# EasyEDA Pro project ProPrj_DRV8701驱动板._2024-08-31.epro

# Board DRV8701
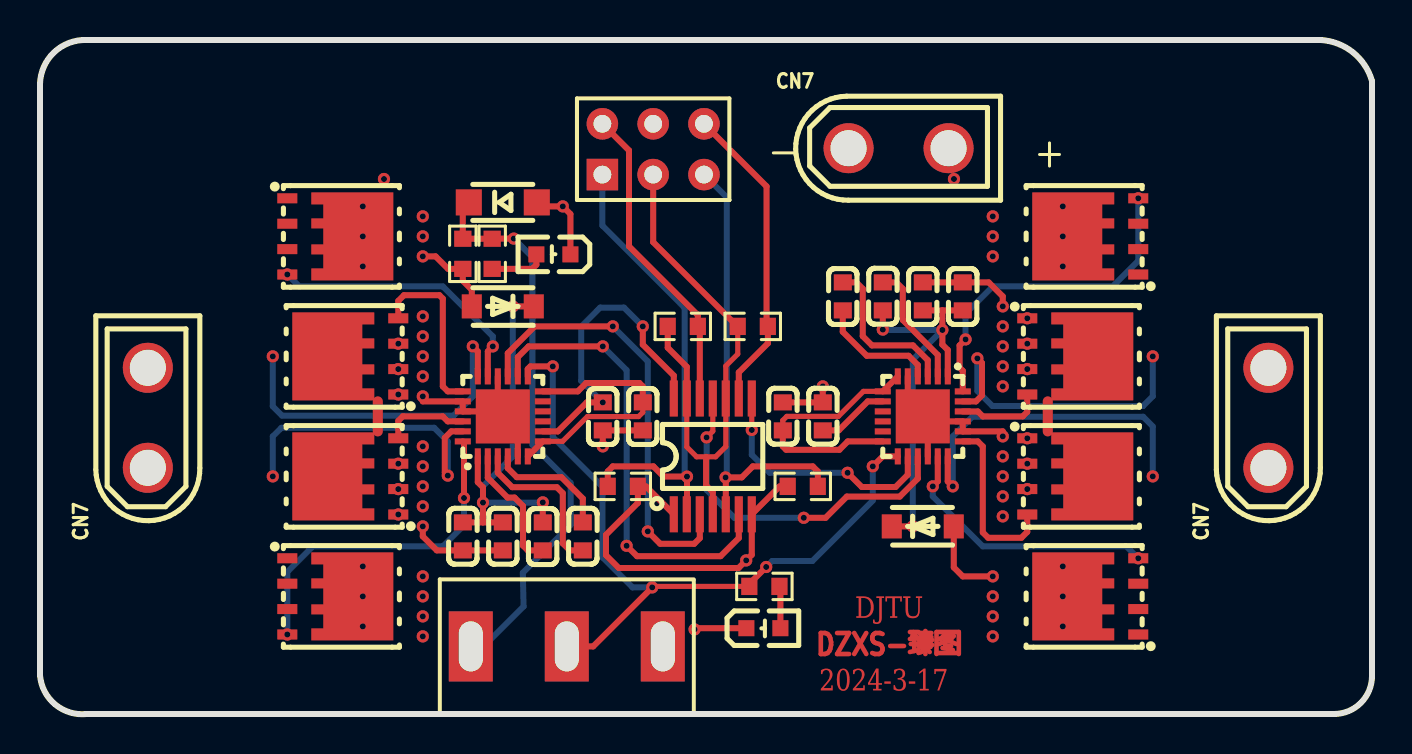
[diagram p0: board, top side]
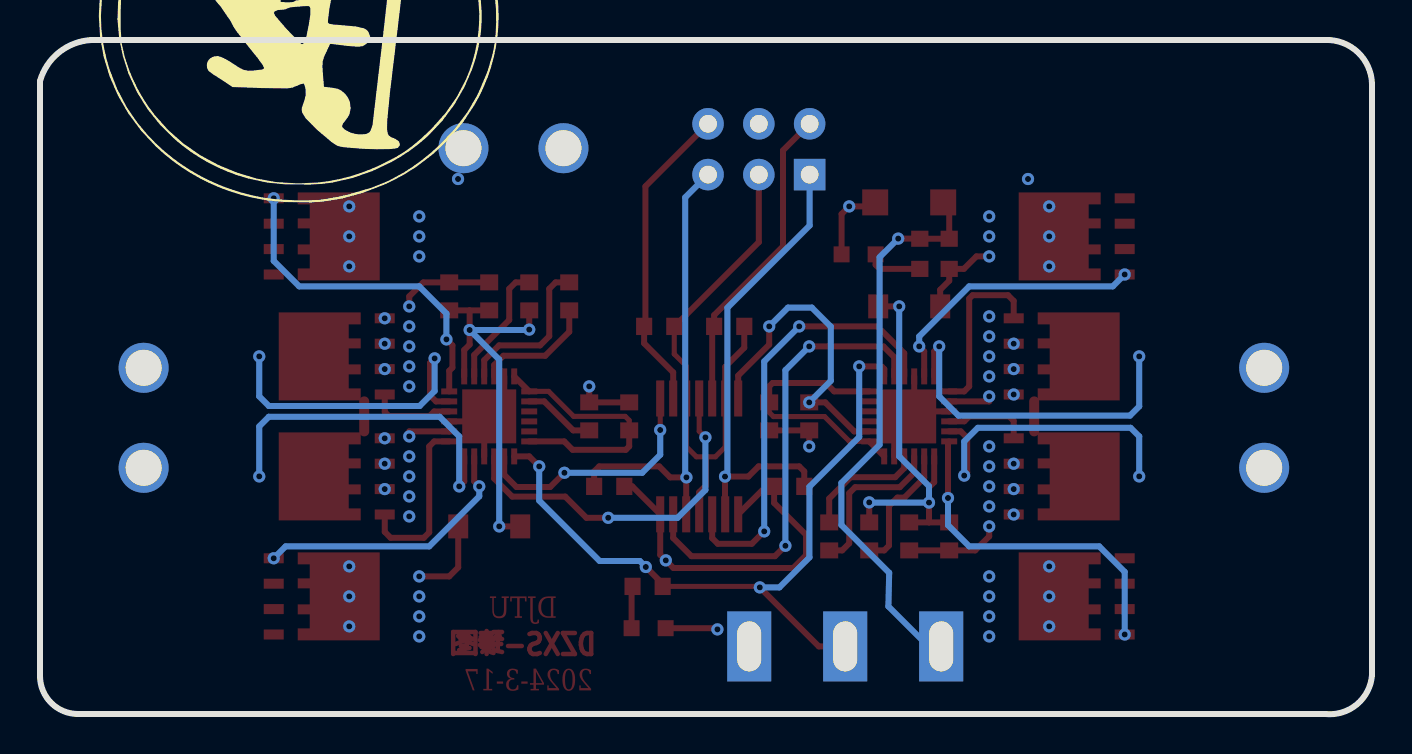
[diagram p1: board, bottom side, seen from below]

Outline 66.6 x 33.7 mm; copper layers: Top Layer, Inner1, Inner2, Bottom Layer. Coordinates in mm from the lower left corner of the outline.
Outline path: 0,31.5 0,1.94 arc(0.76,0.48) 2.34,0 64.71,0 arc(66.05,0.56) 66.6,1.89 66.6,31.65 arc(65.64,33.09) 64.03,33.7 2.34,33.7 arc(0.71,33.09) 0,31.5
Stack: Top Layer 0.035mm / Dielectric1 0.48mm PP er 4.5 / Inner1 0.035mm / Dielectric2 0.48mm FR4 er 4.5 / Inner2 0.035mm / Dielectric3 0.48mm PP er 4.5 / Bottom Layer 0.035mm

## Design rules (mm)
spacing Default (default): track to track 0.152, other pairs 0 to 0.152
track width Default (default): min 0.254, default 0.254, max 25.4
differential pair differentialPair (default): width min 0.127, default 0.254, max 2.54; gap min 0.152, default 0.152
via Default (default): diameter min 0.6, default 0.6, max 100.025; hole min 0.305, default 0.305, max 59.995
net GND uses gge2402
net VM uses gge2708
net L_B uses gge2260
net L_A uses gge2268
net R_A uses gge2396
net R_B uses gge2398
pour e85 uses gge2256
pour e362 uses gge2260
pour e363 uses gge2268
pour e364 uses gge2357
pour e365 uses gge2367
pour e366 uses gge2396
pour e367 uses gge2398
pour e368 uses gge2400
pour e369 uses gge2402
pour e370 uses gge2689
pour e371 uses gge2691
pour e372 uses gge2706
pour e373 uses gge2708

## Placement (name value [footprint] x y rotation side)
C1  100nF  [C0603]  27.14 8.88 270 top
C2  100nF  [C0603]  23.14 8.88 270 top
C3  100nF  [C0603]  40.14 20.88 90 top
C4  100nF  [C0603]  44.14 20.88 90 top
C5  10uF  [C0603]  21.14 8.88 270 top
C6  10uF  [C0603]  46.14 20.88 90 top
C7  1uF  [C0603]  25.14 8.88 90 top
C8  1uF  [C0603]  30.14 14.88 90 top
C9  1uF  [C0603]  28.14 14.88 90 top
C10  1uF  [C0603]  42.14 20.88 270 top
C11  1uF  [C0603]  37.14 14.88 270 top
C12  1uF  [C0603]  39.14 14.88 270 top
CN7  -  [CONN-TH_XT30UPB-M]  5.39 14.81 90 top
CN7#2  -  [CONN-TH_XT30UPB-M]  61.42 14.81 90 top
CN7#3  -  [CONN-TH_XT30UPB-M]  42.93 28.29 0 top
D1  1N5819W  [SOD-123F_L2.8-W1.8-LS3.7-RD]  23.14 20.38 180 top
D2  1N5819W  [SOD-123F_L2.8-W1.8-LS3.7-RD]  44.14 9.38 0 top
D3  BZT52C3V3_C908185  [SOD-123_L2.7-W1.6-LS3.7-RD]  23.14 25.58 0 top
J1  HDR-M-2.54_2x3  [HDR-M-2.54_2X3]  28.12 26.97 0 top
LED1  19-217/GHC-YR1S2/3T  [LED0603-R-RD]  25.67 22.98 180 top
LED2  19-217/GHC-YR1S2/3T  [LED0603-R-RD]  36.17 4.29 0 top
Q1  TPH1R403NL  [POWERVDFN-8_L6.2-W5.2-P1.27-LS6.0-BL]  53.14 23.88 90 top
Q2  TPH1R403NL  [POWERVDFN-8_L6.2-W5.2-P1.27-LS6.0-BL]  51.14 17.88 270 top
Q3  TPH1R403NL  [POWERVDFN-8_L6.2-W5.2-P1.27-LS6.0-BL]  53.14 5.88 90 top
Q4  TPH1R403NL  [POWERVDFN-8_L6.2-W5.2-P1.27-LS6.0-BL]  51.14 11.88 270 top
Q5  TPH1R403NL  [POWERVDFN-8_L6.2-W5.2-P1.27-LS6.0-BL]  16.14 17.88 90 top
Q6  TPH1R403NL  [POWERVDFN-8_L6.2-W5.2-P1.27-LS6.0-BL]  14.14 23.88 270 top
Q7  TPH1R403NL  [POWERVDFN-8_L6.2-W5.2-P1.27-LS6.0-BL]  16.14 11.88 90 top
Q8  TPH1R403NL  [POWERVDFN-8_L6.2-W5.2-P1.27-LS6.0-BL]  14.14 5.88 270 top
R1  10K  [R0603]  29.14 11.38 0 top
R2  10K  [R0603]  38.14 11.38 180 top
R3  10K  [R0603]  32.14 19.38 0 top
R4  10K  [R0603]  35.64 19.38 0 top
R5  330  [R0603]  36.22 6.38 0 top
R6  330  [R0603]  22.61 23.01 90 top
R7  2.2K  [R0603]  21.14 23.01 90 top
S1  SW-SPDT  [SS12D10]  26.34 3.38 180 top
U2  SN74HC125PWR  [TSSOP-14_L5.0-W4.4-P0.65-LS6.5-BL]  33.64 12.88 0 top
U3  DRV  [VQFN-24_L4.0-W4.0-P0.50-LS4.0-BL-EP]  44.14 14.88 180 top
U4  DRV  [VQFN-24_L4.0-W4.0-P0.50-LS4.0-BL-EP]  23.14 14.88 0 top

## Footprints (pads in the part's own frame, mm; a bottom-side part is the same pattern mirrored in y, then rotated)
C0603
  rect 0.8x0.9 smd: 1(-0.7,0) 2(0.7,0)
CONN-TH_XT30UPB-M
  round 2.5 hole 1.8: 1(-2.5,0) 2(2.5,0)
HDR-M-2.54_2X3
  rect 1.575x1.575 hole 0.889: 1(0,0)
  round 1.575 hole 0.889: 2(0,2.54) 3(2.54,0) 4(2.54,2.54) 5(5.08,0) 6(5.08,2.54)
LED0603-R-RD
  rect 0.8x0.8 smd: 1(0.851,0) 2(-0.851,0)
POWERVDFN-8_L6.2-W5.2-P1.27-LS6.0-BL
  rect 0.5x1 smd: 1(-1.905,-1.775) 2(-0.635,-1.775) 3(0.635,-1.775) 4(1.905,-1.775)
  custom 4.4x4.1 smd: 5(0,1.775)
R0603
  rect 0.806x0.864 smd: 1(-0.753,0) 2(0.753,0)
SOD-123_L2.7-W1.6-LS3.7-RD
  rect 1.3x1.3 smd: 1(-1.7,0) 2(1.7,0)
SOD-123F_L2.8-W1.8-LS3.7-RD
  rect 1x1.2 smd: 1(-1.55,0) 2(1.55,0)
SS12D10
  rect 2.2x3.5 hole 1.2x2.5: 1(-4.8,0) 2(0,0) 3(4.8,0)
TSSOP-14_L5.0-W4.4-P0.65-LS6.5-BL
  rect 0.406x1.804 smd: 1(-1.95,-2.896) 2(-1.3,-2.896) 3(-0.65,-2.896) 4(0,-2.896) 5(0.65,-2.896) 6(1.3,-2.896) 7(1.95,-2.896) 8(1.95,2.896) 9(1.3,2.896) 10(0.65,2.896) 11(0,2.896) 12(-0.65,2.896) 13(-1.3,2.896) 14(-1.95,2.896)
VQFN-24_L4.0-W4.0-P0.50-LS4.0-BL-EP
  rect 0.3x0.8 smd: 1(-1.25,-2) 2(-0.75,-2) 3(-0.251,-2) 4(0.25,-2) 5(0.75,-2) 6(1.25,-2) 13(1.25,2) 14(0.75,2) 15(0.249,2) 16(-0.25,2) 17(-0.75,2) 18(-1.25,2)
  rect 0.8x0.3 smd: 7(2.001,-1.25) 8(2.001,-0.75) 9(2.001,-0.249) 10(2.001,0.251) 11(2.001,0.751) 12(2.001,1.25) 19(-2.001,1.25) 20(-2.001,0.75) 21(-2.001,0.251) 22(-2.001,-0.248) 23(-2.001,-0.749) 24(-2.001,-1.249)
  rect 2.7x2.7 smd: 25(0.001,-0.002)

## Nets
3V3: D3.1 R6.2 R7.2 S1.3
DVDD: C9.2 U2.14 U4.8
GND: C2.2 C4.2 C5.2 C6.2 C8.1 C9.1 C11.1 C12.1 D3.2 J1.3 J1.4 LED1.2 LED2.2 Q2.1 Q2.2 Q2.3 Q4.1 Q4.2 Q4.3 Q5.1 Q5.2 Q5.3 Q7.1 Q7.2 Q7.3 R1.2 R2.2 R3.1 R4.1 U2.1 U2.4 U2.7 U2.10 U2.13 U3.5 U3.16 U3.20 U3.21 U3.25 U4.5 U4.16 U4.20 U4.21 U4.25
L_A: Q7.5 Q8.1 Q8.2 Q8.3 U4.23
L_B: Q5.5 Q6.1 Q6.2 Q6.3 U4.18
L_EH_IN: J1.5 R2.1 U2.5
L_EN: U2.6 U4.14
L_PH: U2.3 U4.15
L_PH_IN: J1.1 R1.1 U2.2
NSLEEP: R5.1 S1.2 U3.13 U4.13
R_A: Q1.1 Q1.2 Q1.3 Q2.5 U3.23
R_B: Q3.1 Q3.2 Q3.3 Q4.5 U3.18
R_EH_IN: J1.6 R4.2 U2.9
R_EN: U2.8 U3.14
R_PH: U2.11 U3.15
R_PH_IN: J1.2 R3.2 U2.12
VM: D1.2 D2.2 Q1.5 Q3.5 Q6.5 Q8.5 R7.1
$1N94: Q1.4 U3.24
$1N96: Q2.4 U3.22
$1N118: Q4.4 U3.19
$1N119: Q3.4 U3.17
$1N139: C11.2 U3.6 U3.7 U3.12
$1N142: C3.1 U3.4
$1N143: C3.2 U3.3
$1N144: C10.1 U3.2
$1N145: C4.1 C6.1 C10.2 D2.1 U3.1
$1N161: C2.1 C5.1 C7.2 D1.1 U4.1
$1N168: C7.1 U4.2
$1N169: C1.2 U4.3
$1N170: C1.1 U4.4
$1N172: C8.2 U4.6 U4.7 U4.12
$1N192: Q6.4 U4.17
$1N194: Q5.4 U4.19
$1N215: Q7.4 U4.22
$1N216: Q8.4 U4.24
$1N308: LED1.1 R6.1
$1N555: LED2.1 R5.2
$1N556: C12.2 U3.8

Pads without a net: CN7 1 2; CN7#2 1 2; CN7#3 1 2; S1 1; U3 9 10 11; U4 9 10 11

## Via types
v1: diameter 0.61, hole 0.305, Top Layer to Bottom Layer, 104 vias

## Routing (per net, layer and track width the routed paths; a pad name or vN(x,y) marks a point on that pad's centre or on a via; arc(x,y) is an arc through that point)
3V3: length 28.5
  Top Layer w0.3: 21.44,25.58 21.14,25.28 21.14,23.76 22.61,23.76 22.62,23.77 v1(23.69,23.77)
  Bottom Layer w0.3: S1.3 22.18,3.38 24.18,5.38 24.14,7.06 26.53,9.45 26.53,11.55 24.62,13.46 24.62,22.84 23.69,23.77
DVDD: length 15.9
  Top Layer w0.3: 25.14,14.13 25.89,14.13 27.34,15.58 v1(28.14,15.58) ; 30.14,19.38 30.14,18.47 31.69,16.92 U2.14
  Bottom Layer w0.3: 30.14,19.38 29.2,20.32 28.01,20.32 27.06,19.37 27.06,16.66 v1(28.14,15.58)
  vias: v1(30.14,19.38)
GND: length 88.9
  Top Layer w0.254: 34.89,19.38 34.89,18 34.29,17.4 U2.10 34.29,13.37 33.78,12.86 32.83,12.86 32.34,13.35 U2.13
  Top Layer w0.3: 22.89,15.13 23.14,14.88 23.89,14.13 23.89,12.88 ; 22.89,15.13 U4.21 U4.20 19.14,15.63 v1(19.14,15.88) ; 22.89,15.13 22.89,16.88 ; 37.14,15.58 39.14,15.58 v1(39.14,16.38) ; J1.3 30.66,23.59 34.87,19.38 34.89,19.38 ; 35.31,7.68 35.59,7.96 35.59,9.98 36.99,11.38 37.39,11.38 ; v1(28.14,13.38) 28.14,14.18 30.14,14.18 ; 23.14,8.18 19.84,8.18 19.14,8.88 v1(19.14,9.38) ; U3.25 44.39,14.63 U3.16 ; U3.25 43.39,15.63 43.39,16.88 ; U3.25 44.39,14.63 46.14,14.63 46.14,14.13 48.14,14.13 48.14,13.88 ; 31.69,9.98 30.3,11.38 29.89,11.38 29.89,10.55 28.3,8.96 28.3,7.94 28.94,7.3 34.93,7.3 v1(35.31,7.68) ; 33.31,12.86 33.31,11.42 33.64,11.09 33.64,9.98 ; v1(32.73,4.23) 32.79,4.29 LED2.2 ; 24.84,25.38 v1(26.14,25.38) 26.52,25 LED1.2 ; U2.13 32.34,17.36 31.39,18.31 31.39,19.38 ; 48.14,20.38 48.14,20.88 47.44,21.58 44.14,21.58
  Top Layer w0.5: 16.89,15.63 16.89,14.13 ; 50.39,15.63 50.39,14.13
  vias: v1(17.92,18.52) v1(17.92,17.25) v1(17.92,15.98) v1(17.92,12.52) v1(17.92,11.25) v1(17.92,9.98) v1(19.14,19.88) v1(19.14,18.88) v1(19.14,17.88) v1(19.14,16.88) v1(19.14,13.38) v1(19.14,12.38) v1(19.14,11.38) v1(19.14,10.38) v1(48.14,20.38) v1(48.14,19.38) v1(48.14,18.38) v1(48.14,17.38) v1(48.14,16.38) v1(48.14,13.88) v1(48.14,12.88) v1(48.14,11.88) v1(48.14,10.88) v1(48.14,9.88) v1(49.37,19.79) v1(49.37,18.52) v1(49.37,17.25) v1(49.37,13.79) v1(49.37,12.52) v1(49.37,11.25)
L_A: length 15.9
  Top Layer w0.3: 21.14,14.13 20.56,14.13 20.24,13.81 20.24,12.07 20.39,11.92
  Bottom Layer w0.3: v1(11.64,11.88) 11.64,13.88 12.07,14.31 19.71,14.31 20.39,13.63 20.39,11.92
  vias: v1(20.39,11.92)
L_B: length 17.2
  Top Layer w0.3: U4.18 21.89,18.13 21.64,18.38
  Bottom Layer w0.3: 11.64,17.88 11.64,15.38 12.1,14.92 20.68,14.92 21.64,15.88 21.64,18.38
  vias: v1(11.64,17.88) v1(21.64,18.38)
L_EH_IN: length 23.2
  Top Layer w0.3: 34.29,9.98 34.29,11.82 34.28,11.83 35.09,11.83 35.64,12.38 38.64,12.38 38.89,12.13 R2.1
  Bottom Layer w0.3: J1.5 34.34,25.83 34.34,11.89 v1(34.28,11.83)
L_EN: length 23.3
  Top Layer w0.3: v1(29.33,8.41) 29.85,7.89 34.03,7.89 34.94,8.8 34.94,9.98 ; v1(28.14,18.38) 24.43,18.38 23.89,17.84 23.89,16.88
  Bottom Layer w0.3: v1(28.14,18.38) 29.33,17.19 v1(29.33,8.41)
L_PH: length 22.1
  Top Layer w0.3: 32.99,9.98 32.99,8.79 32.71,8.51 31.01,8.51 30.39,9.13 ; U4.15 23.39,18.04 24.73,19.38 v1(28.64,19.38)
  Bottom Layer w0.3: 30.39,9.13 30.39,17.63 v1(28.64,19.38)
  vias: v1(30.39,9.13)
L_PH_IN: length 23.8
  Top Layer w0.3: 32.34,9.98 32.35,9.99 32.35,11.87 31.18,11.87 30.67,12.38 28.64,12.38 28.39,12.13 28.39,11.38
  Bottom Layer w0.3: J1.1 28.12,24.42 32.23,20.31 32.23,11.99 v1(32.35,11.87)
NSLEEP: length 36.9
  Top Layer w0.254: R5.1 30.66,6.38 v1(30.61,6.33)
  Top Layer w0.3: v1(41.64,12.38) 42.14,12.88 U3.13 ; S1.2 27.66,3.38 v1(30.61,6.33) ; R5.1 35.47,6.51 v1(36.31,7.35) ; U4.13 24.39,17.25 24.52,17.38 25.64,17.38
  Bottom Layer w0.3: 25.64,17.38 25.64,13.85 28.13,11.36 28.13,7.83 29.63,6.33 v1(30.61,6.33) ; v1(41.64,12.38) 41.64,10.67 38.62,7.65 36.61,7.65 v1(36.31,7.35)
  vias: v1(25.64,17.38)
R_A: length 15.9
  Top Layer w0.3: 46.14,15.63 46.8,15.63 47.1,15.93 47.1,17.55 46.87,17.78
  Bottom Layer w0.3: 46.87,17.78 46.87,16.15 47.62,15.4 55.16,15.4 55.64,15.88 55.64,17.88
  vias: v1(46.87,17.78) v1(55.64,17.88)
R_B: length 17.2
  Top Layer w0.3: 45.64,11.38 45.39,11.63 45.39,12.88
  Bottom Layer w0.3: 45.64,11.38 45.64,13.88 46.62,14.86 55.16,14.86 55.64,14.38 v1(55.64,11.88)
  vias: v1(45.64,11.38)
R_EH_IN: length 15.7
  Top Layer w0.3: J1.6 36.33,26.38 36.33,19.44 R4.2 ; 34.94,15.78 34.94,17.08 36.39,18.53 36.39,19.38
R_EN: length 12.5
  Top Layer w0.254: 35.59,15.78 35.59,14.2
  Top Layer w0.3: 40.38,12.06 41.09,11.35 42.78,11.35 43.39,11.96 U3.14
  Bottom Layer w0.3: 40.38,12.06 36.49,12.06 35.59,12.96 35.59,14.2
  vias: v1(35.59,14.2) v1(40.38,12.06)
R_PH: length 17.8
  Top Layer w0.254: v1(33.33,13.83) 33.64,14.14 33.64,15.78
  Top Layer w0.3: v1(38.19,9.81) 39.28,9.81 40.34,10.87 42.99,10.87 43.89,11.77 U3.15
  Bottom Layer w0.3: v1(38.19,9.81) 34.72,9.81 33.33,11.2 v1(33.33,13.83)
R_PH_IN: length 15.8
  Top Layer w0.3: U2.12 32.99,19.38 32.89,19.38 ; R3.2 32.89,19.94 29.45,23.38 29.45,28.18 J1.2
VM: length 8.5
  Top Layer w0.3: 21.59,20.38 21.59,21.21 21.14,21.66 21.14,22.26 20.41,22.26 19.78,22.88 v1(19.14,22.88) ; D2.2 45.69,7.33 46.14,6.88 47.64,6.88
  vias: v1(16.14,25.38) v1(16.14,23.88) v1(16.14,22.38) v1(16.14,7.38) v1(16.14,5.88) v1(16.14,4.38) v1(17.2,26.75) v1(19.14,24.88) v1(19.14,23.88) v1(19.14,6.88) v1(19.14,5.88) v1(19.14,4.88) v1(19.14,3.88) v1(45.7,26.75) v1(47.64,24.88) v1(47.64,23.88) v1(47.64,22.88) v1(47.64,6.88) v1(47.64,5.88) v1(47.64,4.88) v1(47.64,3.88) v1(51.14,25.38) v1(51.14,23.88) v1(51.14,22.38) v1(51.14,7.38) v1(51.14,5.88) v1(51.14,4.38)
$1N94: length 16.9
  Top Layer w0.3: v1(46.28,18.73) 45.98,18.43 45.98,17.32 46.14,17.16 46.14,16.13
  Bottom Layer w0.3: v1(46.28,18.73) 46.28,20.02 47.64,21.38 53.64,21.38 54.92,22.66 v1(54.92,25.79)
$1N96: length 4.3
  Top Layer w0.3: 49.36,15.98 49.36,15.11 49.14,14.88 47.14,14.88 46.89,15.13 46.14,15.13
$1N118: length 8.7
  Top Layer w0.3: 49.36,9.97 49.36,9.11 49.07,8.81 47.41,8.81 47.14,9.08 47.14,13.38 46.89,13.63 46.14,13.63
$1N119: length 13.7
  Top Layer w0.3: 44.64,11.38 44.89,11.63 U3.17
  Bottom Layer w0.3: 44.64,11.38 44.64,10.88 47.14,8.38 54.32,8.38 54.91,7.78
  vias: v1(44.64,11.38) v1(54.92,7.79)
$1N139: length 13.2
  Top Layer w0.254: 42.14,16.13 41.17,16.13 39.92,14.88 37.34,14.88 37.14,14.68 37.14,14.18
  Top Layer w0.3: 42.14,16.13 U3.6 ; 37.14,14.18 37.14,13.38 37.31,13.21 39.97,13.21 40.39,13.63 42.14,13.63
$1N142: length 6.1
  Top Layer w0.3: 40.14,20.18 40.14,19.11 41.34,17.91 43.43,17.91 43.89,17.45 U3.4
$1N143: length 8.1
  Top Layer w0.3: 40.14,21.58 40.82,21.58 41.14,21.26 41.14,18.89 41.6,18.43 43.65,18.43 44.39,17.69 U3.3
$1N144: length 6.2
  Top Layer w0.3: U3.2 44.89,17.95 43.14,19.7 43.14,21.26 42.82,21.58 42.14,21.58
$1N145: length 20.8
  Top Layer w0.3: 42.14,19.22 42.14,20.18 ; U3.1 45.39,18.2 45.12,18.47 v1(45.12,19.2) 45.12,20.18 44.14,20.18 ; 42.59,9.38 43.64,9.38 ; 46.14,20.18 45.14,20.18
  Bottom Layer w0.3: 42.14,19.22 42.16,19.2 v1(45.12,19.2) 43.64,17.72 43.64,9.38
  vias: v1(42.14,19.22) v1(43.64,9.38)
$1N161: length 20.9
  Top Layer w0.3: 21.14,9.58 22.14,9.58 ; C2.1 22.15,9.58 22.15,11.33 21.89,11.59 U4.1 ; D1.1 23.64,20.38 ; C7.2 25.14,10.58
  Bottom Layer w0.3: v1(22.15,10.57) 25.14,10.57 v1(25.14,10.58) ; 22.15,10.57 22.15,11.39 23.64,12.88 23.64,20.38
  vias: v1(23.64,20.38)
$1N168: length 6.5
  Top Layer w0.3: 22.39,12.88 22.39,11.81 23.38,10.82 23.73,10.82 24.15,10.4 24.15,8.42 24.39,8.18 25.14,8.18
$1N169: length 8.1
  Top Layer w0.3: 22.89,12.88 22.89,12.06 23.61,11.34 25.84,11.34 26.14,11.04 26.14,8.53 26.49,8.18 27.14,8.18
$1N170: length 6.2
  Top Layer w0.3: 23.39,12.88 23.39,12.29 23.84,11.84 26.07,11.84 27.14,10.77 C1.1
$1N172: length 13.2
  Top Layer w0.254: 25.14,13.63 26.13,13.63 27.37,14.87 29.93,14.87 30.14,15.08 30.14,15.58
  Top Layer w0.3: 30.14,15.58 30.14,16.38 29.97,16.55 27.31,16.55 26.89,16.13 25.14,16.13 ; U4.6 25.14,13.63
$1N192: length 13.7
  Top Layer w0.3: 22.64,18.38 22.39,18.13 U4.17
  Bottom Layer w0.3: 22.64,18.38 22.64,18.88 20.14,21.38 12.96,21.38 v1(12.37,21.98)
  vias: v1(22.64,18.38)
$1N194: length 8.8
  Top Layer w0.3: Q5.4 17.92,20.66 18.2,20.94 19.97,20.94 20.14,20.77 20.14,16.38 20.39,16.13 21.14,16.13
$1N215: length 4.3
  Top Layer w0.3: 21.14,14.63 20.39,14.63 20.14,14.88 18.14,14.88 17.92,14.66 Q7.4
$1N216: length 17.1
  Top Layer w0.3: 21.14,13.63 21.2,13.57 v1(21.2,10.8)
  Bottom Layer w0.3: 12.37,3.97 12.37,7.11 13.64,8.38 20.14,8.38 21.2,9.44 v1(21.2,10.8)
  vias: v1(12.37,3.98)
$1N308: length 2.8
  Top Layer w0.3: 22.61,22.26 24.62,22.26 24.82,22.46 LED1.1
$1N555: length 2.1
  Top Layer w0.3: LED2.1 37.02,6.33 R5.2
$1N556: length 3.6
  Top Layer w0.3: 39.14,14.18 39.94,14.18 41.39,15.63 42.14,15.63

## Copper pours and planes (outline as drawn; the poured copper is in the pictures)
GND on Top Layer: 16.64,14.38 16.64,8.88 19.64,8.88 19.64,14.38
GND on Top Layer: 16.64,20.38 16.64,15.38 19.64,15.38 19.64,20.38
GND on Top Layer: 47.64,14.38 50.64,14.38 50.64,9.38 47.64,9.38
GND on Top Layer: 47.64,20.88 50.64,20.88 50.64,15.38 47.64,15.38
GND on Inner2: 54.14,2.88 13.14,2.88 13.14,31.18 54.14,31.18
L_A on Top Layer: 1.31,14.38 16.14,14.38 16.14,8.88 13.64,8.88 13.64,2.88 10.64,2.88 10.64,7.88 9.13,9.53 1.41,9.54
L_B on Top Layer: 10.64,26.88 10.64,21.88 9.14,19.81 1.33,19.84 1.38,15.28 16.14,15.38 16.14,20.88 13.64,20.88 13.64,26.88
R_A on Top Layer: 56.64,26.88 56.64,21.88 58.14,20.38 64.37,20.38 64.32,15.3 51.14,15.38 51.14,20.88 53.64,20.88 53.64,26.88
R_B on Top Layer: 51.14,14.38 64.39,14.28 64.3,9.51 58.14,9.38 56.64,7.88 56.64,2.88 53.64,2.88 53.64,8.88 51.14,8.88
VM on Top Layer: 47.14,26.88 50.64,26.88 50.64,22.38 47.14,22.38
VM on Top Layer: 16.64,2.88 16.64,7.38 19.64,7.38 19.64,2.88
VM on Top Layer: 16.64,26.88 16.64,22.38 19.64,22.38 19.64,26.88
VM on Top Layer: 47.14,7.38 50.64,7.38 50.64,2.88 47.14,2.88
VM on Inner1: 13.14,31.13 13.14,2.88 54.14,2.88 54.14,31.13

## Text on the board
Top Layer: DZXS-臻图 | 2024-3-17 | DJTU
Top Silkscreen Layer: - | +
